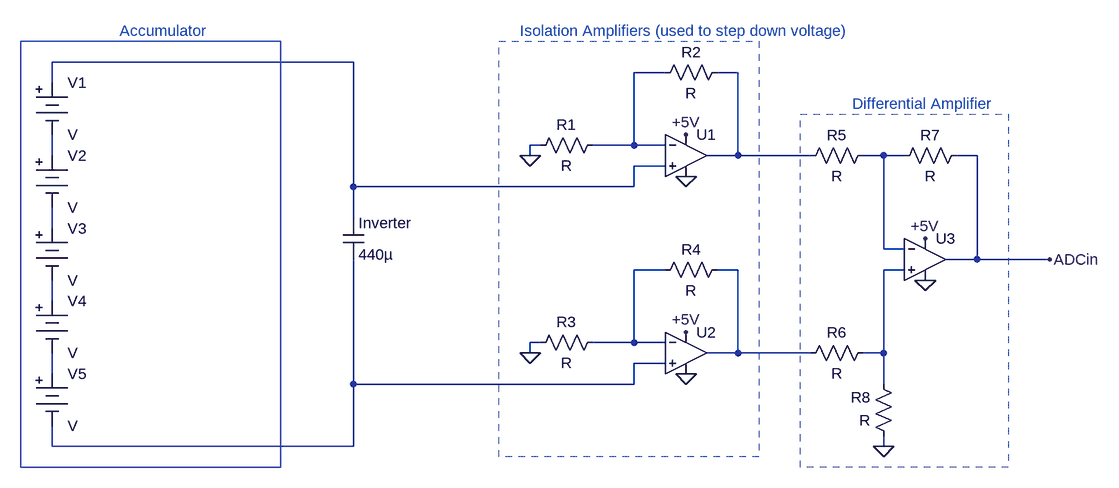
[diagram p0: schematic Voltage Sensing with Isolation.asc]
Voltage Sensing with Isolation.asc, the LTspice schematic file:
Version 4
SHEET 1 880 804
WIRE -480 -32 -944 -32
WIRE 0 -16 -48 -16
WIRE 112 -16 80 -16
WIRE -944 0 -944 -32
WIRE -192 96 -208 96
WIRE -48 96 -48 -16
WIRE -48 96 -112 96
WIRE 0 96 -48 96
WIRE -944 112 -944 80
WIRE -208 112 -208 96
WIRE 112 112 112 -16
WIRE 112 112 64 112
WIRE 224 112 112 112
WIRE 336 112 304 112
WIRE 368 112 336 112
WIRE 480 112 448 112
WIRE 0 128 -48 128
WIRE -480 160 -480 -32
WIRE -48 160 -48 128
WIRE -48 160 -480 160
WIRE -480 208 -480 160
WIRE -944 224 -944 192
WIRE 336 256 336 112
WIRE 368 256 336 256
WIRE 480 272 480 112
WIRE 480 272 432 272
WIRE 592 272 480 272
WIRE 0 288 -48 288
WIRE 112 288 80 288
WIRE 368 288 336 288
WIRE -944 336 -944 304
WIRE -192 400 -208 400
WIRE -48 400 -48 288
WIRE -48 400 -112 400
WIRE 0 400 -48 400
WIRE -208 416 -208 400
WIRE 112 416 112 288
WIRE 112 416 64 416
WIRE 224 416 112 416
WIRE 336 416 336 288
WIRE 336 416 304 416
WIRE 0 432 -48 432
WIRE -944 448 -944 416
WIRE -480 464 -480 272
WIRE -48 464 -48 432
WIRE -48 464 -480 464
WIRE 336 464 336 416
WIRE -944 560 -944 528
WIRE -480 560 -480 464
WIRE -480 560 -944 560
WIRE 336 560 336 544
FLAG 32 144 0
FLAG 32 448 0
FLAG -208 416 0
FLAG -208 112 0
FLAG 336 560 0
FLAG 592 272 ADCin
FLAG 32 80 +5V
FLAG 32 384 +5V
FLAG 400 240 +5V
FLAG 400 304 0
SYMBOL OpAmps\\UniversalOpAmp 32 112 R0
SYMATTR InstName U1
SYMBOL OpAmps\\UniversalOpAmp 400 272 R0
SYMATTR InstName U3
SYMBOL res -96 80 R90
WINDOW 0 0 56 VBottom 2
WINDOW 3 32 56 VTop 2
SYMATTR InstName R1
SYMBOL res 96 -32 R90
WINDOW 0 0 56 VBottom 2
WINDOW 3 32 56 VTop 2
SYMATTR InstName R2
SYMBOL OpAmps\\UniversalOpAmp 32 416 R0
SYMATTR InstName U2
SYMBOL res -96 384 R90
WINDOW 0 0 56 VBottom 2
WINDOW 3 32 56 VTop 2
SYMATTR InstName R3
SYMBOL res 96 272 R90
WINDOW 0 0 56 VBottom 2
WINDOW 3 32 56 VTop 2
SYMATTR InstName R4
SYMBOL res 320 96 R90
WINDOW 0 0 56 VBottom 2
WINDOW 3 32 56 VTop 2
SYMATTR InstName R5
SYMBOL res 320 400 R90
WINDOW 0 0 56 VBottom 2
WINDOW 3 32 56 VTop 2
SYMATTR InstName R6
SYMBOL res 464 96 R90
WINDOW 0 0 56 VBottom 2
WINDOW 3 32 56 VTop 2
SYMATTR InstName R7
SYMBOL res 352 560 R180
WINDOW 0 36 76 Left 2
WINDOW 3 36 40 Left 2
SYMATTR InstName R8
SYMBOL cap -496 208 R0
SYMATTR InstName Inverter
SYMATTR Value 440µ
SYMBOL Misc\\battery -944 -16 R0
SYMATTR InstName V1
SYMBOL Misc\\battery -944 96 R0
SYMATTR InstName V2
SYMBOL Misc\\battery -944 208 R0
SYMATTR InstName V3
SYMBOL Misc\\battery -944 320 R0
SYMATTR InstName V4
SYMBOL Misc\\battery -944 432 R0
SYMATTR InstName V5
TEXT 288 32 Left 2 ;Differential Amplifier
TEXT -224 -80 Left 2 ;Isolation Amplifiers (used to step down voltage)
TEXT -840 -80 Left 2 ;Accumulator
RECTANGLE Normal 528 592 208 48 2
RECTANGLE Normal 144 576 -256 -64 2
RECTANGLE Normal -592 592 -992 -64

The netlist it stands for:
* Voltage Sensing with Isolation.asc
XU1 N001 N002 +5V 0 N003 level1 Avol=1Meg GBW=10Meg Vos=0 En=0 Enk=0 In=0 Ink=0 Rin=500Meg  ; pins In+ In- V+ V- OUT
XU3 N009 N005 +5V 0 ADCin level1 Avol=1Meg GBW=10Meg Vos=0 En=0 Enk=0 In=0 Ink=0 Rin=500Meg  ; pins In+ In- V+ V- OUT
R1 N002 0 R
R2 N003 N002 R
XU2 N011 N007 +5V 0 N008 level1 Avol=1Meg GBW=10Meg Vos=0 En=0 Enk=0 In=0 Ink=0 Rin=500Meg  ; pins In+ In- V+ V- OUT
R3 N007 0 R
R4 N008 N007 R
R5 N005 N003 R
R6 N009 N008 R
R7 ADCin N005 R
R8 0 N009 R
C§Inverter N001 N011 440µ
V1 N001 N004 V
V2 N004 N006 V
V3 N006 N010 V
V4 N010 N012 V
V5 N012 N011 V
* Differential Amplifier
* Isolation Amplifiers (used to step down voltage)
* Accumulator
.lib UniversalOpAmp1.lib
.backanno
.end